# Altium project Dasch240Xl.PrjPcb
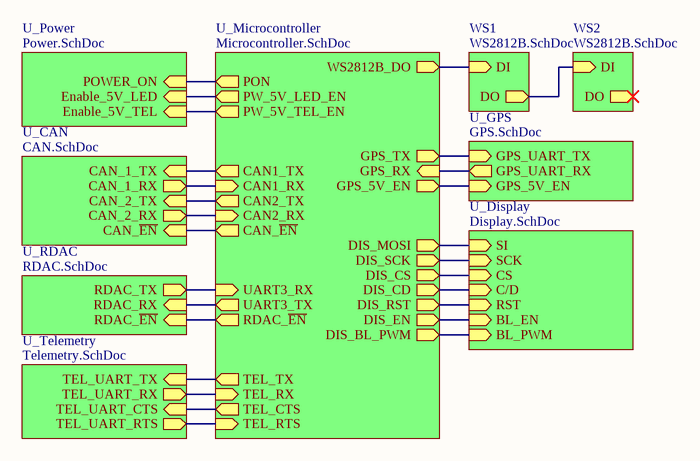
[diagram p0: Main.SchDoc]
9 sheets, 184 parts. Net scope: hierarchical (ports join the sheet entries above them; power ports are global).
Board files: PCB_SingleLedRow.PcbDoc, PCB.PcbDoc
Sheets:
  Main.SchDoc
    WS1 = WS2812B.SchDoc
    WS2 = WS2812B.SchDoc
    U_Display = Display.SchDoc
    U_Microcontroller = Microcontroller.SchDoc
    U_Telemetry = Telemetry.SchDoc
    U_GPS = GPS.SchDoc
    U_CAN = CAN.SchDoc
    U_Power = Power.SchDoc
    U_RDAC = RDAC.SchDoc

## Sheet Main.SchDoc
size A4

### Sub-sheets
U_CAN = CAN.SchDoc: CAN_1_TX (in), CAN_1_RX (out), CAN_2_RX (out), CAN_2_TX (in), CAN_~{EN} (in)
U_Display = Display.SchDoc: SI (in), SCK (in), RST (in), CS (in), C/D (in), BL_EN (in), BL_PWM (in)
U_GPS = GPS.SchDoc: GPS_UART_TX (in), GPS_UART_RX (out), GPS_5V_EN (in)
U_Microcontroller = Microcontroller.SchDoc: WS2812B_DO (out), GPS_TX (out), GPS_RX (in), TEL_TX (out), TEL_RX (in), TEL_CTS (out), TEL_RTS (in), CAN2_RX (in), CAN2_TX (out), CAN1_RX (in), CAN1_TX (out), DIS_CS (out), DIS_SCK (out), DIS_CD (out), DIS_MOSI (out), CAN_~{EN} (out), UART3_TX (out), UART3_RX (in), RDAC_~{EN} (out), GPS_5V_EN (out), DIS_EN (out), DIS_RST (out), PW_5V_TEL_EN (out), PW_5V_LED_EN (out), PON (out), DIS_BL_PWM (out)
U_Power = Power.SchDoc: Enable_5V_LED (in), Enable_5V_TEL (in), POWER_ON (in)
U_RDAC = RDAC.SchDoc: RDAC_TX (out), RDAC_RX (in), RDAC_~{EN} (in)
U_Telemetry = Telemetry.SchDoc: TEL_UART_TX (in), TEL_UART_RX (out), TEL_UART_CTS (in), TEL_UART_RTS (out)
WS1 = WS2812B.SchDoc: DI (in), DO (out)
WS2 = WS2812B.SchDoc: DI (in), DO (out)

### Nets
CAN1_RX: sheet U_Microcontroller/CAN1_RX, sheet U_CAN/CAN_1_RX
CAN1_TX: sheet U_Microcontroller/CAN1_TX, sheet U_CAN/CAN_1_TX
CAN2_RX: sheet U_Microcontroller/CAN2_RX, sheet U_CAN/CAN_2_RX
CAN2_TX: sheet U_Microcontroller/CAN2_TX, sheet U_CAN/CAN_2_TX
CAN_~{EN}: sheet U_Microcontroller/CAN_~{EN}, sheet U_CAN/CAN_~{EN}
GPS_RX: sheet U_Microcontroller/GPS_TX, sheet U_GPS/GPS_UART_TX
GPS_TX: sheet U_Microcontroller/GPS_RX, sheet U_GPS/GPS_UART_RX
SPI2_CD: sheet U_Display/C/D, sheet U_Microcontroller/DIS_CD
SPI2_MOSI: sheet U_Display/SI, sheet U_Microcontroller/DIS_MOSI
SPI2_NSS: sheet U_Display/CS, sheet U_Microcontroller/DIS_CS
SPI2_SCK: sheet U_Display/SCK, sheet U_Microcontroller/DIS_SCK
TEL_CTS: sheet U_Microcontroller/TEL_RTS, sheet U_Telemetry/TEL_UART_RTS
TEL_RTS: sheet U_Microcontroller/TEL_CTS, sheet U_Telemetry/TEL_UART_CTS
TEL_RX: sheet U_Microcontroller/TEL_TX, sheet U_Telemetry/TEL_UART_TX
TEL_TX: sheet U_Microcontroller/TEL_RX, sheet U_Telemetry/TEL_UART_RX
NetD1_WS1_4: sheet WS1/DI, sheet U_Microcontroller/WS2812B_DO
NetD1_WS2_4: sheet WS1/DO, sheet WS2/DI
NetD25_2: sheet U_Microcontroller/PON, sheet U_Power/POWER_ON
NetDISP_37: sheet U_Display/RST, sheet U_Microcontroller/DIS_RST
NetQ2_4: sheet U_Microcontroller/GPS_5V_EN, sheet U_GPS/GPS_5V_EN
NetQ3_1: sheet U_Microcontroller/RDAC_~{EN}, sheet U_RDAC/RDAC_~{EN}
NetQ4_4: sheet U_Display/BL_EN, sheet U_Microcontroller/DIS_EN
NetR15_2: sheet U_Microcontroller/PW_5V_LED_EN, sheet U_Power/Enable_5V_LED
NetR16_2: sheet U_Microcontroller/PW_5V_TEL_EN, sheet U_Power/Enable_5V_TEL
NetRaceDAC_3: sheet U_Microcontroller/UART3_RX, sheet U_RDAC/RDAC_TX
NetRaceDAC_4: sheet U_Microcontroller/UART3_TX, sheet U_RDAC/RDAC_RX
NetU1_4: sheet U_Display/BL_PWM, sheet U_Microcontroller/DIS_BL_PWM

## Sheet WS2812B.SchDoc
size A4
Used 2 times, as channels WS1, WS2. Parts and nets are listed once, with the designators drawn on the sheet.
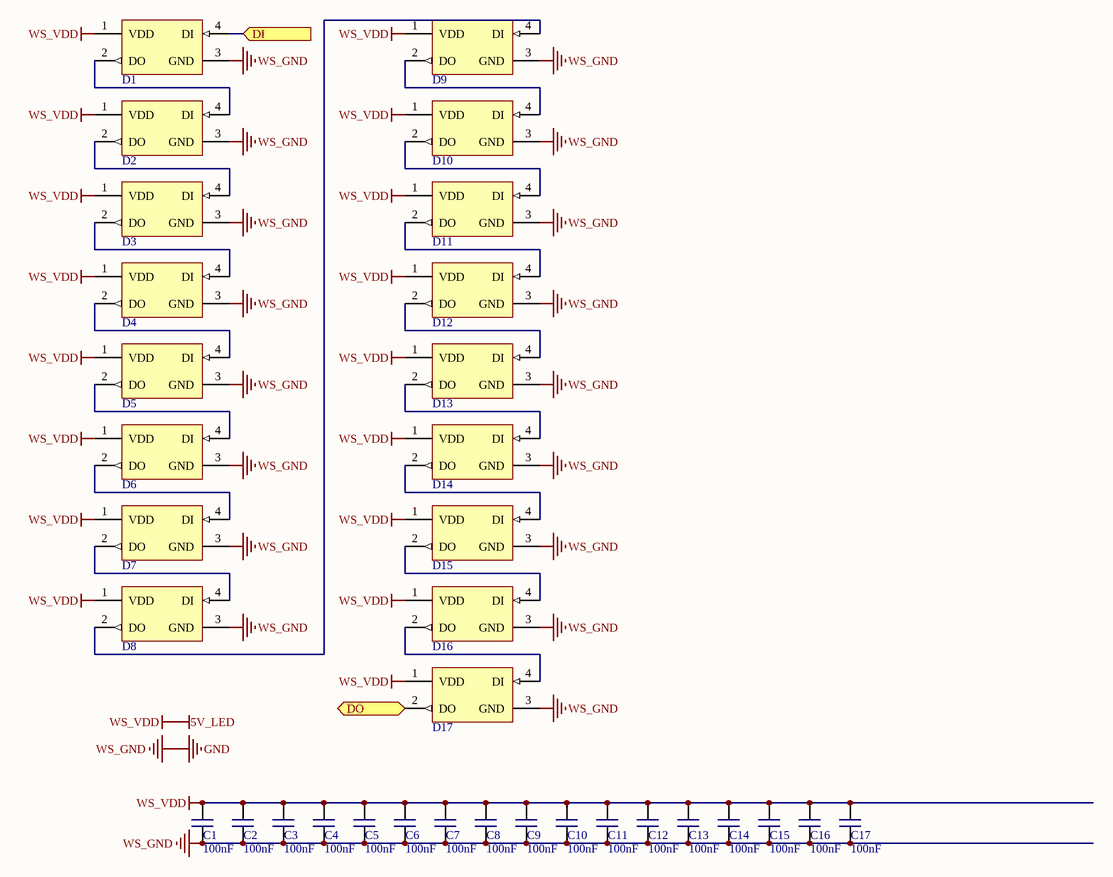
[diagram p1: WS2812B.SchDoc]

### Parts
C1  100nF  [C0603H08_M]
C2  100nF  [C0603H08_M]
C3  100nF  [C0603H08_M]
C4  100nF  [C0603H08_M]
C5  100nF  [C0603H08_M]
C6  100nF  [C0603H08_M]
C7  100nF  [C0603H08_M]
C8  100nF  [C0603H08_M]
C9  100nF  [C0603H08_M]
C10  100nF  [C0603H08_M]
C11  100nF  [C0603H08_M]
C12  100nF  [C0603H08_M]
C13  100nF  [C0603H08_M]
C14  100nF  [C0603H08_M]
C15  100nF  [C0603H08_M]
C16  100nF  [C0603H08_M]
C17  100nF  [C0603H08_M]
D1  WS2812B  [WS2812B]  (value not drawn)
D2  WS2812B  [WS2812B]  (value not drawn)
D3  WS2812B  [WS2812B]  (value not drawn)
D4  WS2812B  [WS2812B]  (value not drawn)
D5  WS2812B  [WS2812B]  (value not drawn)
D6  WS2812B  [WS2812B]  (value not drawn)
D7  WS2812B  [WS2812B]  (value not drawn)
D8  WS2812B  [WS2812B]  (value not drawn)
D9  WS2812B  [WS2812B]  (value not drawn)
D10  WS2812B  [WS2812B]  (value not drawn)
D11  WS2812B  [WS2812B]  (value not drawn)
D12  WS2812B  [WS2812B]  (value not drawn)
D13  WS2812B  [WS2812B]  (value not drawn)
D14  WS2812B  [WS2812B]  (value not drawn)
D15  WS2812B  [WS2812B]  (value not drawn)
D16  WS2812B  [WS2812B]  (value not drawn)
D17  WS2812B  [WS2812B]  (value not drawn)

### Ports
DI (in), DO (out)

### Nets
5V_LED: C1.2 C2.2 C3.2 C4.2 C5.2 C6.2 C7.2 C8.2 C9.2 C10.2 C11.2 C12.2 C13.2 C14.2 C15.2 C16.2 C17.2 D1.1(VDD) D2.1(VDD) D3.1(VDD) D4.1(VDD) D5.1(VDD) D6.1(VDD) D7.1(VDD) D8.1(VDD) D9.1(VDD) D10.1(VDD) D11.1(VDD) D12.1(VDD) D13.1(VDD) D14.1(VDD) D15.1(VDD) D16.1(VDD) D17.1(VDD)  [also labelled WS_VDD]
GND: C1.1 C2.1 C3.1 C4.1 C5.1 C6.1 C7.1 C8.1 C9.1 C10.1 C11.1 C12.1 C13.1 C14.1 C15.1 C16.1 C17.1 D1.3(GND) D2.3(GND) D3.3(GND) D4.3(GND) D5.3(GND) D6.3(GND) D7.3(GND) D8.3(GND) D9.3(GND) D10.3(GND) D11.3(GND) D12.3(GND) D13.3(GND) D14.3(GND) D15.3(GND) D16.3(GND) D17.3(GND)  [also labelled WS_GND]
DI: D1.4(DI) ; port DI
DO: D17.2(DO) ; port DO
NetD1_2: D1.2(DO) D2.4(DI)
NetD2_2: D2.2(DO) D3.4(DI)
NetD3_2: D3.2(DO) D4.4(DI)
NetD4_2: D4.2(DO) D5.4(DI)
NetD5_2: D5.2(DO) D6.4(DI)
NetD6_2: D6.2(DO) D7.4(DI)
NetD7_2: D7.2(DO) D8.4(DI)
NetD8_2: D8.2(DO) D9.4(DI)
NetD9_2: D9.2(DO) D10.4(DI)
NetD10_2: D10.2(DO) D11.4(DI)
NetD11_2: D11.2(DO) D12.4(DI)
NetD12_2: D12.2(DO) D13.4(DI)
NetD13_2: D13.2(DO) D14.4(DI)
NetD14_2: D14.2(DO) D15.4(DI)
NetD15_2: D15.2(DO) D16.4(DI)
NetD16_2: D16.2(DO) D17.4(DI)

### Channels
WS1: designators end in _WS1; ports DI=NetD1_WS1_4 DO=NetD1_WS2_4
WS2: designators end in _WS2; ports DI=NetD1_WS2_4 DO=NetD17_WS2_2

### Library data of the parts
C1-C17 = C 100nF 100V 0603 MLCC X7R: Form: 0603 [M 1608]; Temperature Coeffizient: 0ppm/°C +- 30ppm/°C; Tolerance: +-10%; Price: 0.044; Series: X7R; Voltage Rating: 100V; Temperature Range: -55°C to +125°C; Value: 100nF
D1-D17 = WS2812B: WS2812B RGB LED

## Sheet Display.SchDoc
size A4
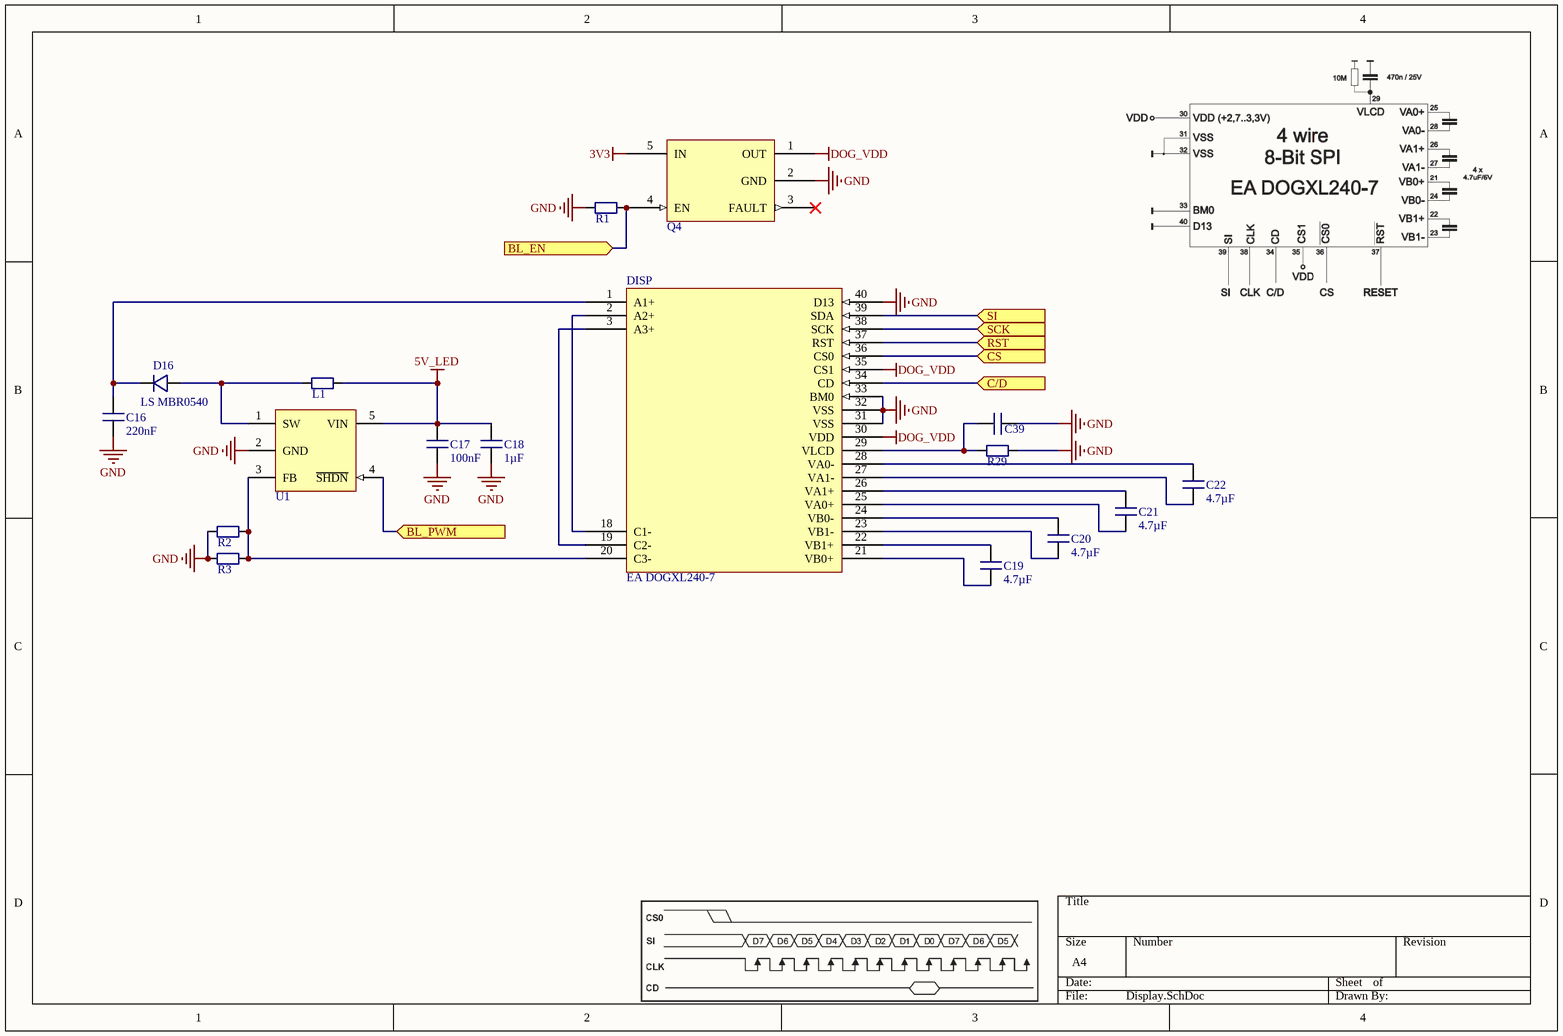
[diagram p2: Display.SchDoc]

### Parts
C16  220nF  [C0805H085_L]
C17  100nF  [C0603H08_M]
C18  1µF  [C0603H08_M]
C19  4.7µF  [C0603H08_L]
C20  4.7µF  [C0603H08_L]
C21  4.7µF  [C0603H08_L]
C22  4.7µF  [C0603H08_L]
C39  TO BE DEFINED!  [C0805H06_M]  (value not drawn)
D16  LS MBR0540  [SOD123_H]
DISP  EA DOGXL240-7  [DOGXL240*-7 + LED]
L1  .Resistor  [R0805H05_M]  (value not drawn)
Q4  Enhanced single channel power switches  [SOT-23-5]  (value not drawn)
R1  .Resistor  [R0603H05_M]  (value not drawn)
R2  .Resistor  [R0805H05_M]  (value not drawn)
R3  .Resistor  [R0805H05_M]  (value not drawn)
R29  .Resistor  [R0603H05_M]  (value not drawn)
U1  CAT4238  [SOT-23-5]  (value not drawn)

### Ports
BL_EN (in), BL_PWM (in), C/D (in), CS (in), RST (in), SCK (in), SI (in)

### Nets
3V3: Q4.5(IN)
5V_LED: C17.1 C18.1 L1.2 U1.5(VIN)
DOG_VDD: DISP.30(VDD) DISP.35(CS1) Q4.1(OUT)
GND: C16.1 C17.2 C18.2 C39.2 DISP.31(VSS) DISP.32(VSS) DISP.33(BM0) DISP.40(D13) Q4.2(GND) R1.1 R2.1 R3.1 R29.2 U1.2(GND)
SPI2_CD: DISP.34(CD) ; port C/D
SPI2_MOSI: DISP.39(SDA) ; port SI
SPI2_NSS: DISP.36(CS0) ; port CS
SPI2_SCK: DISP.38(SCK) ; port SCK
NetC16_2: C16.2 D16.1 DISP.1(A1+)
NetC19_1: C19.1 DISP.22(VB1+)
NetC19_2: C19.2 DISP.21(VB0+)
NetC20_1: C20.1 DISP.24(VB0-)
NetC20_2: C20.2 DISP.23(VB1-)
NetC21_1: C21.1 DISP.26(VA1+)
NetC21_2: C21.2 DISP.25(VA0+)
NetC22_1: C22.1 DISP.28(VA0-)
NetC22_2: C22.2 DISP.27(VA1-)
NetC39_1: C39.1 DISP.29(VLCD) R29.1
NetD16_2: D16.2 L1.1 U1.1(SW)
NetDISP_2: DISP.2(A2+) DISP.18(C1-)
NetDISP_3: DISP.3(A3+) DISP.19(C2-)
NetDISP_20: DISP.20(C3-) R2.2 R3.2 U1.3(FB)
NetDISP_37: DISP.37(RST) ; port RST
NetQ4_4: Q4.4(EN) R1.2 ; port BL_EN
NetU1_4: U1.4(~{SHDN}) ; port BL_PWM

Not connected (* = marked no-connect by the designer): Q4 3(FAULT)*

### Library data of the parts
C16 = C 220nF 50V 0805 MLCC  Y5V: Form: 0805 [M 2012]; Tolerance: +80%, -20%; Farnell Order Number: 1759269; Price: 0.0252; Series: V5Y; Voltage Rating: 50V; Temperature Range: -30°C to +85°C; Value: 220nF
C17 = C 100nF 100V 0603 MLCC X7R: as C1 on sheet WS2812B; Price: 0.044; Series: X7R; Voltage Rating: 100V; Temperature Range: -55°C to +125°C; Value: 100nF
C18 = C 1µF 6.3V 0603 MLCC X7R: Form: 0603 [M 1608]; Tolerance: +-10%; Farnell Order Number: 1865556; Price: 0.028; Series: X7R; Voltage Rating: 6.3V; Temperature Range: -55°C to +125°C; Temperature Coeffizient: N/A; Farnell: http://de.farnell.com/kemet/c0603c105k9ractu/kondensator-x7r-0603-6-3v-1uf/dp/1865556; Value: 1µF
C19-C22 = C 4.7µF 6.3V 0603 MLCC X5R: Form: 0603 [M 1608]; Tolerance: +-10%; Farnell Order Number: 2496930; Price: 0.045; Series: X5R; Voltage Rating: 6.3V; Temperature Range: -55°C to +85°C; Value: 4.7µF
C39 = _C 0805
D16 = LS MBR0540: Schottky Rectifier, 500mA, 40V
DISP = EA DOGXL240-7: 240x128
Q4 = HSS STMPS2151 High Side Switch 500mA (2151)/1000mA (2161): Farnell: http://de.farnell.com/stmicroelectronics/stmps2161str/power-switch-1ch-1000ma-sot23-5/dp/1842615; Farnell Order Number: 1842615; Price: 0,651
U1 = STU CAT4238: High Efficiency 10 LED  Boost Converter

## Sheet Microcontroller.SchDoc
size A4
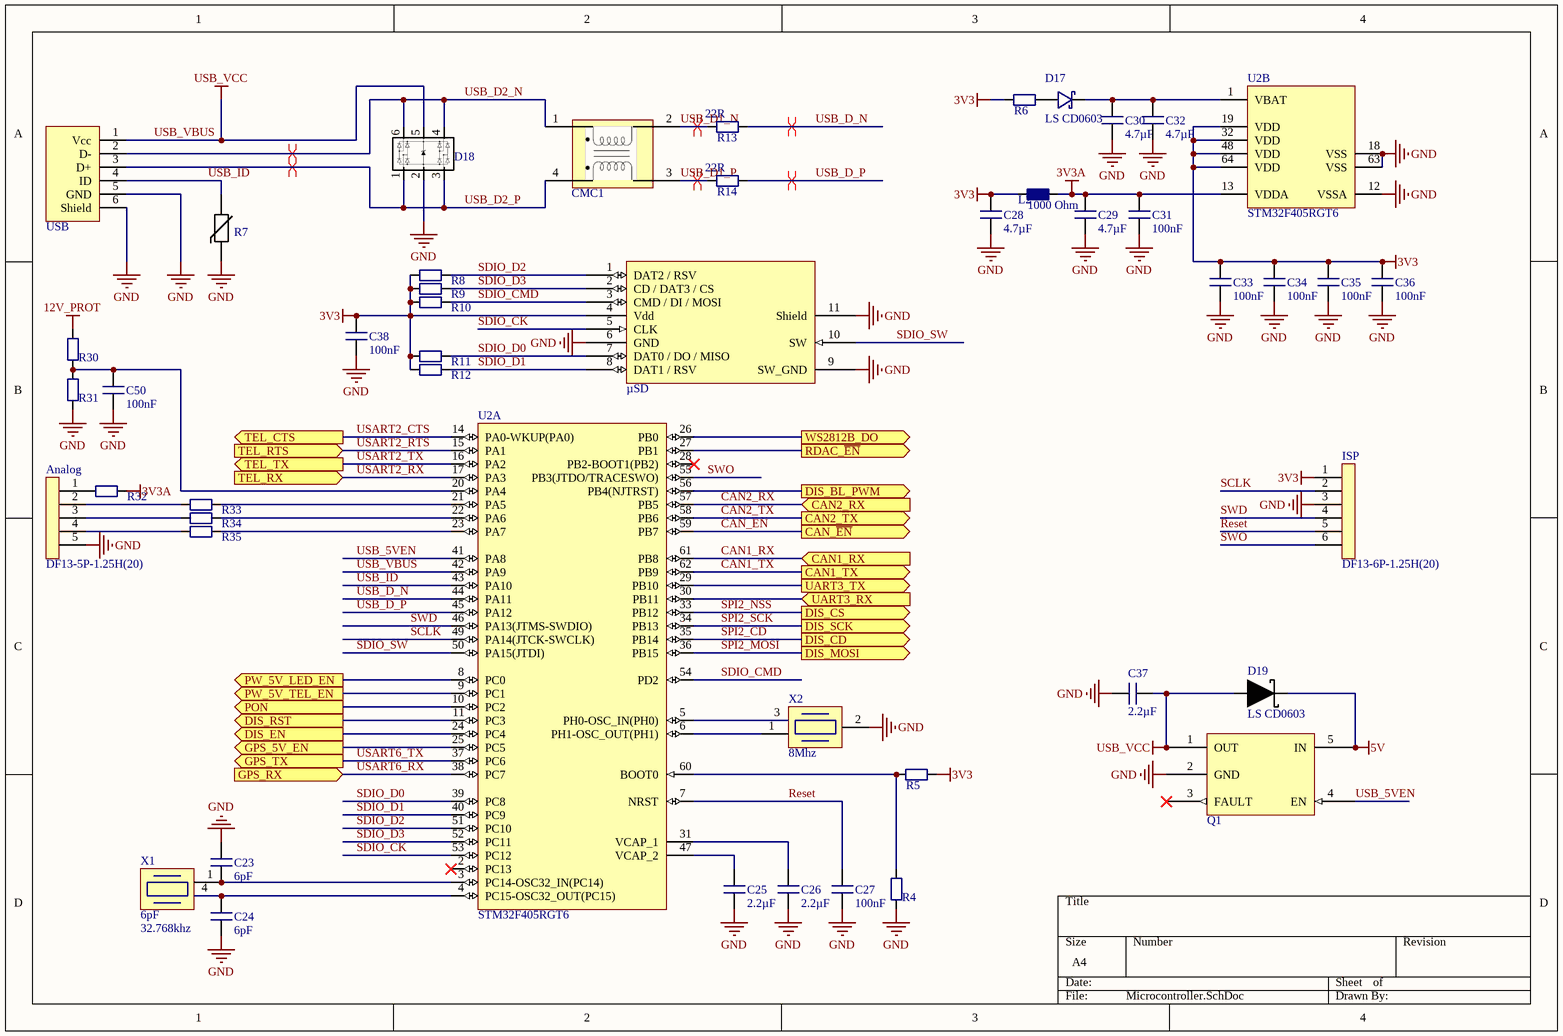
[diagram p3: Microcontroller.SchDoc]

### Parts
Analog  DF13-5P-1.25H(20)  [DF13-5P-1.25H(20)]
C23  6pF  [C0603H08_L]
C24  6pF  [C0603H08_L]
C25  2.2µF  [C0603H08_M]
C26  2.2µF  [C0603H08_M]
C27  100nF  [C0603H08_M]
C28  4.7µF  [C0603H08_L]
C29  4.7µF  [C0603H08_L]
C30  4.7µF  [C0603H08_L]
C31  100nF  [C0603H08_M]
C32  4.7µF  [C0603H08_L]
C33  100nF  [C0603H08_M]
C34  100nF  [C0603H08_M]
C35  100nF  [C0603H08_M]
C36  100nF  [C0603H08_M]
C37  2.2µF  [C0603H08_M]
C38  100nF  [C0603H08_M]
C50  100nF  [C0603H08_M]
CMC1  WURTH ELEKTRONIK - 744232090 - SIGNALFILTER, SMD, 90OHM, 370MA  [Murata 1206 CMC]  (value not drawn)
D17  LS CD0603  [CD 0603]
D18  WURTH ELEKTRONIK - 824015 - DIODENARRAY, TVS  [SOT95P255X116-6N]  (value not drawn)
D19  LS CD0603  [CD 0603]
ISP  DF13-6P-1.25H(20)  [DF13-6P-1.25H(20)]
L2  Value @ 100Mhz: 1000 Ohm  [R0603H05_L]  (hidden comment: 742792515)
Q1  Enhanced single channel power switches  [SOT-23-5]  (value not drawn)
R4  .Resistor  [R0603H05_M]  (value not drawn)
R5  .Resistor  [R0603H05_M]  (value not drawn)
R6  .Resistor  [R0603H05_M]  (value not drawn)
R7  Varistor 0805 4V WE 82550040  [Varistor 0805]  (value not drawn)
R8  .Resistor  [R0603H05_M]  (value not drawn)
R9  .Resistor  [R0603H05_M]  (value not drawn)
R10  .Resistor  [R0603H05_M]  (value not drawn)
R11  .Resistor  [R0603H05_M]  (value not drawn)
R12  .Resistor  [R0603H05_M]  (value not drawn)
R13  22R  [R0402H04_M]
R14  22R  [R0402H04_M]
R30  .Resistor  [R0603H05_M]  (value not drawn)
R31  .Resistor  [R0603H05_M]  (value not drawn)
R32  .Resistor  [R0603H05_M]  (value not drawn)
R33  .Resistor  [R0603H05_M]  (value not drawn)
R34  .Resistor  [R0603H05_M]  (value not drawn)
R35  .Resistor  [R0603H05_M]  (value not drawn)
U2  STM32F405RGT6  [STM-LQFP64_N]  (parts A,B of 2)
USB  Molex Micro USB B  [Micro USB Molex]  (value not drawn)
X1  value 32.768khz  Load: 6pF  [Abracon ABS25 Series Crystal]  (hidden comment: ABRACON - ABS25-32.768KHZ-6-1-T - QUARZ, 32.768KHZ, 6PF, SMD)
X2  value 8Mhz  [CSTCE_G15]  (hidden comment: 8MHz, 33pF)
µSD  Micro SD Connector  [Micro SD Connector 502774]  (value not drawn)

### Ports
CAN1_RX (in), CAN1_TX (out), CAN2_RX (in), CAN2_TX (out), CAN_~{EN} (out), DIS_BL_PWM (out), DIS_CD (out), DIS_CS (out), DIS_EN (out), DIS_MOSI (out), DIS_RST (out), DIS_SCK (out), GPS_5V_EN (out), GPS_RX (in), GPS_TX (out), PON (out), PW_5V_LED_EN (out), PW_5V_TEL_EN (out), RDAC_~{EN} (out), TEL_CTS (out), TEL_RTS (in), TEL_RX (in), TEL_TX (out), UART3_RX (in), UART3_TX (out), WS2812B_DO (out)

### Nets
3V3: C28.1 C33.1 C34.1 C35.1 C36.1 C38.1 ISP.1 L2.1 R5.2 R6.1 R8.1 R9.1 R10.1 R11.1 R12.1 U2.19(VDD) U2.32(VDD) U2.48(VDD) U2.64(VDD) µSD.4(Vdd)
3V3A: C29.1 C31.1 L2.2 R32.2 U2.13(VDDA)
5V: D19.1(C) Q1.5(IN)
12V_PROT: R30.2
GND: Analog.5 C23.1 C24.2 C25.2 C26.2 C27.2 C28.2 C29.2 C30.2 C31.2 C32.2 C33.2 C34.2 C35.2 C36.2 C37.1 C38.2 C50.2 D18.2 ISP.3 Q1.2(GND) R4.1 R7.2 R31.1 U2.12(VSSA) U2.18(VSS) U2.63(VSS) USB.5(GND) USB.6(Shield) X2.2 µSD.6(GND) µSD.9(SW_GND) µSD.11(Shield)
USB_VBUS: C37.2 D18.5 D19.2(A) Q1.1(OUT) U2.42(PA9) USB.1(Vcc)  [also labelled USB_VCC]
CAN1_RX: U2.61(PB8) ; port CAN1_RX
CAN1_TX: U2.62(PB9) ; port CAN1_TX
CAN2_RX: U2.57(PB5) ; port CAN2_RX
CAN2_TX: U2.58(PB6) ; port CAN2_TX
CAN_EN: U2.59(PB7) ; port CAN_~{EN}  [project net CAN_~{EN}]
Reset: C27.1 ISP.5 U2.7(NRST)
SCLK: ISP.2 U2.49(PA14(JTCK-SWCLK))
SDIO_CK: U2.53(PC12) µSD.5(CLK)
SDIO_CMD: R10.2 U2.54(PD2) µSD.3(CMD_/_DI_/_MOSI)
SDIO_D0: R11.2 U2.39(PC8) µSD.7(DAT0_/_DO_/_MISO)
SDIO_D1: R12.2 U2.40(PC9) µSD.8(DAT1_/_RSV)
SDIO_D2: R8.2 U2.51(PC10) µSD.1(DAT2_/_RSV)
SDIO_D3: R9.2 U2.52(PC11) µSD.2(CD_/_DAT3_/_CS)
SDIO_SW: U2.50(PA15(JTDI)) µSD.10(SW)
SPI2_CD: U2.35(PB14) ; port DIS_CD
SPI2_MOSI: U2.36(PB15) ; port DIS_MOSI
SPI2_NSS: U2.33(PB12) ; port DIS_CS
SPI2_SCK: U2.34(PB13) ; port DIS_SCK
SWD: ISP.4 U2.46(PA13(JTMS-SWDIO))
SWO: ISP.6 U2.55(PB3(JTDO/TRACESWO))
USART2_CTS: U2.14(PA0-WKUP(PA0)) ; port TEL_CTS  [project net TEL_RTS]
USART2_RTS: U2.15(PA1) ; port TEL_RTS  [project net TEL_CTS]
USART2_RX: U2.17(PA3) ; port TEL_RX  [project net TEL_TX]
USART2_TX: U2.16(PA2) ; port TEL_TX  [project net TEL_RX]
USART6_RX: U2.38(PC7) ; port GPS_RX  [project net GPS_TX]
USART6_TX: U2.37(PC6) ; port GPS_TX  [project net GPS_RX]
USB_5VEN: Q1.4(EN) U2.41(PA8)
USB_D1_N: CMC1.2 R13.1
USB_D1_P: CMC1.3 R14.1
USB_D2_N: CMC1.1 D18.4 D18.6 USB.2(D-)
USB_D2_P: CMC1.4 D18.1 D18.3 USB.3(D+)
USB_D_N: R13.2 U2.44(PA11)
USB_D_P: R14.2 U2.45(PA12)
USB_ID: R7.1 U2.43(PA10) USB.4(ID)
NetAnalog_1: Analog.1 R32.1
NetAnalog_2: Analog.2 R33.1
NetAnalog_3: Analog.3 R34.1
NetAnalog_4: Analog.4 R35.1
NetC23_2: C23.2 U2.3(PC14-OSC32_IN(PC14)) X1.1
NetC24_1: C24.1 U2.4(PC15-OSC32_OUT(PC15)) X1.4
NetC25_1: C25.1 U2.47(VCAP_2)
NetC26_1: C26.1 U2.31(VCAP_1)
NetC30_1: C30.1 C32.1 D17.2 U2.1(VBAT)
NetC50_1: C50.1 R30.1 R31.2 U2.20(PA4)
NetD1_WS1_4: U2.26(PB0) ; port WS2812B_DO
NetD17_1: D17.1 R6.2
NetD25_2: U2.10(PC2) ; port PON
NetDISP_37: U2.11(PC3) ; port DIS_RST
NetQ2_4: U2.25(PC5) ; port GPS_5V_EN
NetQ3_1: U2.27(PB1) ; port RDAC_~{EN}
NetQ4_4: U2.24(PC4) ; port DIS_EN
NetR4_2: R4.2 R5.1 U2.60(BOOT0)
NetR15_2: U2.8(PC0) ; port PW_5V_LED_EN
NetR16_2: U2.9(PC1) ; port PW_5V_TEL_EN
NetR33_2: R33.2 U2.21(PA5)
NetR34_2: R34.2 U2.22(PA6)
NetR35_2: R35.2 U2.23(PA7)
NetRaceDAC_3: U2.30(PB11) ; port UART3_RX
NetRaceDAC_4: U2.29(PB10) ; port UART3_TX
NetU1_4: U2.56(PB4(NJTRST)) ; port DIS_BL_PWM
NetU2_5: U2.5(PH0-OSC_IN(PH0)) X2.3
NetU2_6: U2.6(PH1-OSC_OUT(PH1)) X2.1

Not connected (* = marked no-connect by the designer): Q1 3(FAULT)*; U2 2(PC13)* 28(PB2-BOOT1(PB2))*; X1 2 3

### Layout directives
differential pair: USB_D1_N, USB_D1_P, USB_D2_N, USB_D2_P, USB_D_N, USB_D_P

### Library data of the parts
Analog = Hirose DF13-5P-1.25H(20): Circuits: 5; Connector Orientation: Right Angle; Model: DF13-5P-1.25H(20); Mounting Style: SMT
C23 C24 = C 6pF 50V 0603 MLCC C0G/NP0: Form: 0603 [M 1608]; Temperature Coeffizient: 0ppm/°C +- 30ppm/°C; Tolerance: +-0.5pF; Farnell Order Number: 1759047; Price: 0.009; Series: C0G/NP0; Voltage Rating: 50V; Temperature Range: -55°C to +125°C; Value: 6pF
C25 C26 C37 = C 2.2µF 6.3V 0603 MLCC X7R: Form: 0603 [M 1608]; Tolerance: +-10%; Farnell Order Number: 1657930; Price: 0.131; Series: X7R; Voltage Rating: 6.3V; Temperature Range: -55°C to +125°C; Temperature Coeffizient: N/A; Farnell: http://de.farnell.com/avx/06036c225kat2a/kondensator-2-2-uf-6-3v-0603-x7r/dp/1657930; Value: 2.2µF
C27 C31 C33-C36 C38 C50 = C 100nF 100V 0603 MLCC X7R: as C1 on sheet WS2812B; Price: 0.044; Series: X7R; Voltage Rating: 100V; Temperature Range: -55°C to +125°C; Value: 100nF
C28-C30 C32 = C 4.7µF 6.3V 0603 MLCC X5R: Form: 0603 [M 1608]; Tolerance: +-10%; Farnell Order Number: 2496930; Price: 0.045; Series: X5R; Voltage Rating: 6.3V; Temperature Range: -55°C to +85°C; Value: 4.7µF
CMC1 = USB CMC 1206 WE 744232090 Chip CommonMod Choke 1206: Farnell: http://de.farnell.com/wurth-elektronik/744232090/signalfilter-smd-90ohm-370ma/dp/1636474; Farnell Order Number: 1636474; Price: 0.969
D18 = USB TVS Dioden Array 824015: Farnell: http://de.farnell.com/wurth-elektronik/824015/diodenarray-tvs/dp/1748615; Price: 0.866; Farnell Order Number: 1748615
ISP = Hirose DF13-6P-1.25H(20): Circuits: 6; Connector Orientation: Right Angle; Model: DF13-6P-1.25H(20); Mounting Style: SMT
L2 = Ferrit Bead 0603 1000Ohm 300mA: DC: 0.55Ohm; Farnell: http://de.farnell.com/fair-rite/25060310270/ferrite-perle-1000ohm-0-1-0603/dp/1463451; Price: 0.018; Farnell Order Number: 1463451; DC Current: 300mA
Q1 = HSS STMPS2151 High Side Switch 500mA (2151)/1000mA (2161): Farnell: http://de.farnell.com/stmicroelectronics/stmps2161str/power-switch-1ch-1000ma-sot23-5/dp/1842615; Farnell Order Number: 1842615; Price: 0,651
R7 = Varistor 0805 4V WE 82550040: WURTH ELEKTRONIK - 82550040 - SMD VARISTOR POWER 0805 4VRMS; Farnell: http://de.farnell.com/wurth-elektronik/82550040/smd-varistor-power-0805-4vrms/dp/1636439?Ntt=1636439; Farnell Order Number: 1636439; Price: 0.598
R13 R14 = .Resistor: Value: 22R
U2 = STM32F405RGT6: ARM Cortex-M4 32-bit MCU+FPU, 210 DMIPS, 1024 kB Flash, 192 kB Internal RAM, 51 I/Os, 64-pin LQFP, -40 to 85 degC, Tray; Manufacturer: STMicroelectronics; D/A Converter: 2x12-bit; FLASH Size (Prog) (kB): 1024; I/Os (High Current): 51; Internal RAM Size (kB): 192; Operating Frequency(F) (Processor speed) (MHz): 168; Supply Voltage(Vcc) max (V): 3.6; Supply Voltage(Vcc) min (V): 1.8; DatasheetVersion: Rev. 4; PackageVersion: Rev. 4, 06/2013; PackageReference: LQFP64; PackageDescription: 64-Pin Low Profile Quad Flat Package, 10 x 10 mm Body, 0.5 mm Pitch; Supplier 1: Digi-Key; Supplier Part Number 1: 497-11767-ND; Supplier 2: Farnell; Supplier Part Number 2: 2064363; Supplier 3: Newark; Supplier Part Number 3: 73T2329; Supplier 4: Mouser; Supplier Part Number 4: 511-STM32F405RGT6; Core: ARM Cortex-M4; Packing: Tray; Mounting Technology: Surface Mount; PartNumber: STM32F405RGT6; ComponentLink1Description: Manufacturer URL; ComponentLink1URL: http://www.st.com/web/en/home.html; ComponentLink2Description: Datasheet; ComponentLink2URL: http://www.st.com/st-web-ui/static/active/en/resource/technical/document/datasheet/DM00037051.pdf; ComponentLink3Description: Package Specification; ComponentLink3URL: http://www.st.com/st-web-ui/static/active/en/resource/technical/document/datasheet/DM00037051.pdf
USB = Molex Micro USB B: MOLEX - 105017-0001 - MICRO USB B, BUCHSE, SMT, RWKL, 5POL; Farnell: http://de.farnell.com/molex/105017-0001/micro-usb-b-buchse-smt-rwkl-5pol/dp/2293836?Ntt=105017-0001; Price: 0.738; Farnell Order Number: 2293836
X1 = Quarz 32.768khz: Farnell: http://de.farnell.com/abracon/abs25-32-768khz-6-1-t/quarz-32-768khz-6pf-smd/dp/2101353; Farnell Order Number: 2101353; Price: 0.741
X2 = Ceramic Resonator 8Mhz: MURATA - CSTCE8M00G55Z-R0 - RESONATOR,SMD 8.0MHZ; Farnell: http://de.farnell.com/murata/cstce8m00g55z-r0/resonator-smd-8-0mhz/dp/1615352; Farnell Order Number: 1615352; Price: 0.338
µSD = Molex MicroSD 502774: MOLEX - 502774-0891 - BUCHSE, MICROSD, PUSH-PUSH, 1.8MM; Farnell: http://de.farnell.com/molex/502774-0891/buchse-microsd-push-push-1-8mm/dp/2064063; Farnell Order Number: 2064063; Price: 1.98

## Sheet Telemetry.SchDoc
size A4
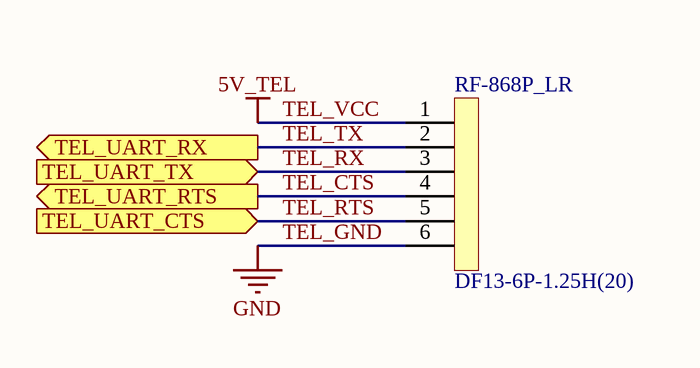
[diagram p4: Telemetry.SchDoc]

### Parts
RF-868P_LR  DF13-6P-1.25H(20)  [DF13-6P-1.25H(20)]

### Ports
TEL_UART_CTS (in), TEL_UART_RTS (out), TEL_UART_RX (out), TEL_UART_TX (in)

### Nets
GND: RF-868P_LR.6  [also labelled TEL_GND]
TEL_VCC: RF-868P_LR.1  [also labelled 5V_TEL]
TEL_CTS: RF-868P_LR.4 ; port TEL_UART_RTS
TEL_RTS: RF-868P_LR.5 ; port TEL_UART_CTS
TEL_RX: RF-868P_LR.3 ; port TEL_UART_TX
TEL_TX: RF-868P_LR.2 ; port TEL_UART_RX

### Library data of the parts
RF-868P_LR = Hirose DF13-6P-1.25H(20): as ISP on sheet Microcontroller; Model: DF13-6P-1.25H(20); Mounting Style: SMT

## Sheet GPS.SchDoc
size A4
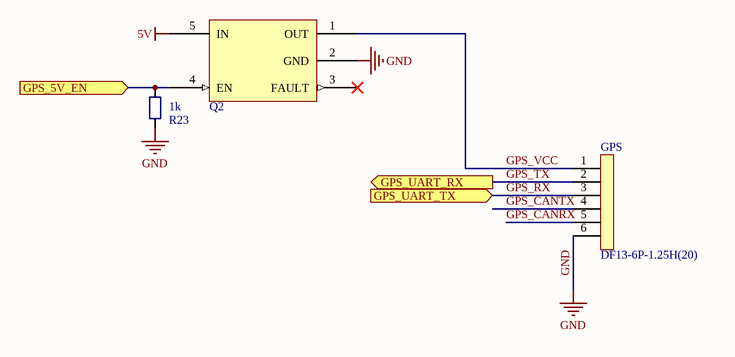
[diagram p5: GPS.SchDoc]

### Parts
GPS  DF13-6P-1.25H(20)  [DF13-6P-1.25H(20)]
Q2  Enhanced single channel power switches  [SOT-23-5]  (value not drawn)
R23  1k  [R0603H05_M]

### Ports
GPS_5V_EN (in), GPS_UART_RX (out), GPS_UART_TX (in)

### Nets
5V: Q2.5(IN)
GND: GPS.6 Q2.2(GND) R23.2
GPS_CANRX: GPS.5
GPS_CANTX: GPS.4
GPS_RX: GPS.3 ; port GPS_UART_TX
GPS_TX: GPS.2 ; port GPS_UART_RX
GPS_VCC: GPS.1 Q2.1(OUT)
NetQ2_4: Q2.4(EN) R23.1 ; port GPS_5V_EN

Not connected (* = marked no-connect by the designer): Q2 3(FAULT)*

### Library data of the parts
GPS = Hirose DF13-6P-1.25H(20): as ISP on sheet Microcontroller; Model: DF13-6P-1.25H(20); Mounting Style: SMT
Q2 = HSS STMPS2151 High Side Switch 500mA (2151)/1000mA (2161): Farnell: http://de.farnell.com/stmicroelectronics/stmps2161str/power-switch-1ch-1000ma-sot23-5/dp/1842615; Farnell Order Number: 1842615; Price: 0,651
R23 = .Resistor: Value: 1k

## Sheet CAN.SchDoc
size A4
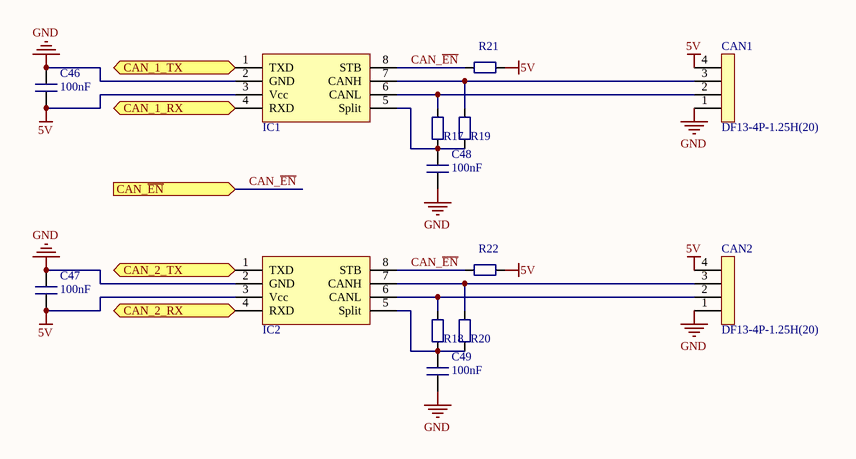
[diagram p6: CAN.SchDoc]

### Parts
C46  100nF  [C0603H08_M]
C47  100nF  [C0603H08_M]
C48  100nF  [C0603H08_M]
C49  100nF  [C0603H08_M]
CAN1  DF13-4P-1.25H(20)  [DF13-4P-1.25H(20)]
CAN2  DF13-4P-1.25H(20)  [DF13-4P-1.25H(20)]
IC1  CAN Transceiver SN65HVD1040A  [SOIC127P600X175-8N]  (value not drawn)
IC2  CAN Transceiver SN65HVD1040A  [SOIC127P600X175-8N]  (value not drawn)
R17  .Resistor  [R0603H05_M]  (value not drawn)
R18  .Resistor  [R0603H05_M]  (value not drawn)
R19  .Resistor  [R0603H05_M]  (value not drawn)
R20  .Resistor  [R0603H05_M]  (value not drawn)
R21  .Resistor  [R0603H05_M]  (value not drawn)
R22  .Resistor  [R0603H05_M]  (value not drawn)

### Ports
CAN_1_RX (out), CAN_1_TX (in), CAN_2_RX (out), CAN_2_TX (in), CAN_~{EN} (in)

### Nets
5V: C46.2 C47.2 CAN1.4 CAN2.4 IC1.3(Vcc) IC2.3(Vcc) R21.2 R22.2
GND: C46.1 C47.1 C48.2 C49.2 CAN1.1 CAN2.1 IC1.2(GND) IC2.2(GND)
CAN1_RX: IC1.4(RXD) ; port CAN_1_RX
CAN1_TX: IC1.1(TXD) ; port CAN_1_TX
CAN2_RX: IC2.4(RXD) ; port CAN_2_RX
CAN2_TX: IC2.1(TXD) ; port CAN_2_TX
CAN_~{EN}: IC1.8(STB) IC2.8(STB) R21.1 R22.1 ; port CAN_~{EN}
NetC48_1: C48.1 IC1.5(Split) R17.2 R19.2
NetC49_1: C49.1 IC2.5(Split) R18.2 R20.2
NetCAN1_2: CAN1.2 IC1.6(CANL) R17.1
NetCAN1_3: CAN1.3 IC1.7(CANH) R19.1
NetCAN2_2: CAN2.2 IC2.6(CANL) R18.1
NetCAN2_3: CAN2.3 IC2.7(CANH) R20.1

### Library data of the parts
C46-C49 = C 100nF 100V 0603 MLCC X7R: as C1 on sheet WS2812B; Price: 0.044; Series: X7R; Voltage Rating: 100V; Temperature Range: -55°C to +125°C; Value: 100nF
CAN1 CAN2 = Hirose DF13-4P-1.25H(20): Circuits: 4; Connector Orientation: Right Angle; Model: DF13-4P-1.25H(20); Mounting Style: SMT
IC1 IC2 = CAN Transceiver SN65HVD1040A: EMC-OPTIMIZED HIGH SPEED CAN TRANSCEIVER; Farnell Order Number: 2335646; Price: 1.41; Farnell: http://de.farnell.com/texas-instruments/sn65hvd1040aqdrq1/can-transceiver-1mbps-1dr-1rx-soic/dp/2335646

## Sheet Power.SchDoc
size A4
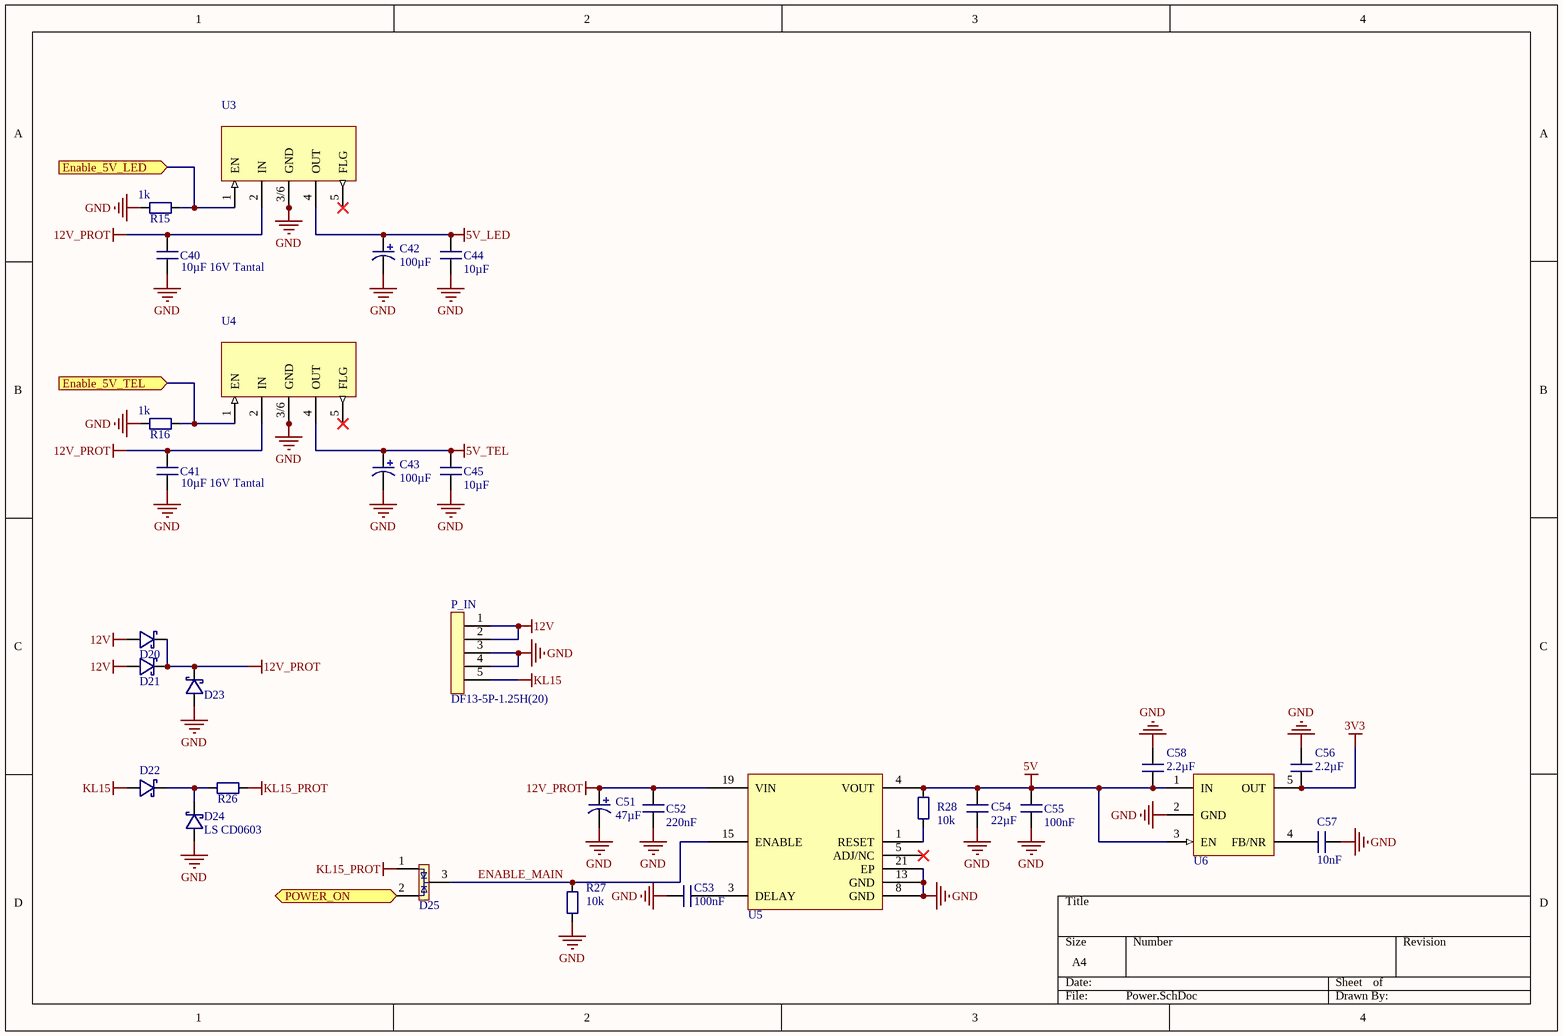
[diagram p7: Power.SchDoc]

### Parts
C40  10µF 16V Tantal  [C1206H08_M]
C41  10µF 16V Tantal  [C1206H08_M]
C42  100µF  [C1210_TANTAL_M]
C43  100µF  [C1210_TANTAL_M]
C44  10µF  [C0603H08_L]
C45  10µF  [C0603H08_L]
C51  47µF  [C1210_TANTAL_M]
C52  220nF  [C0805H085_L]
C53  100nF  [C0603H08_M]
C54  22µF  [C1210H125_M]
C55  100nF  [C0603H08_M]
C56  2.2µF  [C0603H08_M]
C57  10nF  [C0603H08_M]
C58  2.2µF  [C0603H08_M]
D20  LS PMEG6020ER  [SOD-123W]  (value not drawn)
D21  LS PMEG6020ER  [SOD-123W]  (value not drawn)
D22  LS CD0603  [CD 0603]  (value not drawn)
D23  LS PMEG6020ER  [SOD-123W]  (value not drawn)
D24  LS CD0603  [CD 0603]
D25  Diode Array BAT_54C  [SOT95P245X110-3N]  (value not drawn)
P_IN  DF13-5P-1.25H(20)  [DF13-5P-1.25H(20)]
R15  1k  [R0603H05_M]
R16  1k  [R0603H05_M]
R26  .Resistor  [R0603H05_M]  (value not drawn)
R27  10k  [R0603H05_M]
R28  10k  [R0603H05_M]
U3  MIC29151-5.0  [5-Pin TO-263]  (value not drawn)
U4  MIC29151-5.0  [5-Pin TO-263]  (value not drawn)
U5  TPS7B6750  [TSOP65P640X120_HS-21N]  (value not drawn)
U6  LDO TPS799xx Ultra Low Noise, HIGH PSRR, 200mA  [SOT-23-5]  (value not drawn)

### Ports
Enable_5V_LED (in), Enable_5V_TEL (in), POWER_ON (in)

### Nets
3V3: C56.2 U6.5(OUT)
5V: C54.1 C55.2 C58.2 R28.2 U5.4(VOUT) U6.1(IN) U6.3(EN)
5V_LED: C42.1 C44.1 U3.4(OUT)
5V_TEL: C43.1 C45.1 U4.4(OUT)  [project net TEL_VCC]
12V: D20.2 D21.2 P_IN.1 P_IN.2
12V_PROT: C40.1 C41.1 C51.1 C52.2 D20.1 D21.1 D23.1 U3.2(IN) U4.2(IN) U5.19(VIN)
GND: C40.2 C41.2 C42.2 C43.2 C44.2 C45.2 C51.2 C52.1 C53.1 C54.2 C55.1 C56.1 C57.2 C58.1 D23.2 D24.1 P_IN.3 P_IN.4 R15.1 R16.1 R27.1 U3.3(GND) U3.6(GND) U4.3(GND) U4.6(GND) U5.8(GND) U5.13(GND) U5.21(EP) U6.2(GND)
KL15: D22.1 P_IN.5
KL15_PROT: D25.1(A1) R26.2
ENABLE_MAIN: D25.3(C1/A2) R27.2 U5.15(ENABLE)
NetC53_2: C53.2 U5.3(DELAY)
NetC57_1: C57.1 U6.4(FB/NR)
NetD22_2: D22.2 D24.2 R26.1
NetD25_2: D25.2(C2) ; port POWER_ON
NetR15_2: R15.2 U3.1(EN) ; port Enable_5V_LED
NetR16_2: R16.2 U4.1(EN) ; port Enable_5V_TEL
NetR28_1: R28.1 U5.1(RESET)

Not connected (* = marked no-connect by the designer): U3 5(FLG)*; U4 5(FLG)*; U5 5(ADJ/NC)*

### Notes on the sheet
- (in symbol LDO MIC29151 5V 1.5A 26VIN Enable Error Flag TO-263-5) 3/6

### Library data of the parts
C40 C41 = _C 1206: Value: 10µF 16V Tantal; mouser: 581-TAJA106K016TNJ
C42 C43 = CPT 100µF 6.3V 1210 Tantal: Mouser Order Number: 581-TPSB107K006R0400; Voltage Rating: 6.3V; Mouser: http://www.mouser.de/ProductDetail/AVX/TPSB107K006R0400; Value: 100µF
C44 C45 = C 10µF 6.3V 0603 MLCC X5R: Form: 0603 [M 1608]; Tolerance: +-20%; Farnell Order Number: 1833804; Price: 0.167; Series: X5R; Voltage Rating: 6.3V; Temperature Range: -55°C to + 85°C; Temperature Coeffizient: N/A; Farnell: http://de.farnell.com/avx/06036d106mat2a/kondensator-0603-x5r-6-3v-10uf/dp/1833804; Value: 10µF
C51 = CPT 100µF 6.3V 1210 Tantal: CPT 47µF 16V 1210 Tantal; Mouser Order Number: 581-TCNT476M016R0150; Voltage Rating: 16V; Value: 47µF
C52 = C 220nF 50V 0805 MLCC  Y5V: as C16 on sheet Display; Farnell Order Number: 1759269; Price: 0.0252; Series: V5Y; Voltage Rating: 50V; Temperature Range: -30°C to +85°C; Value: 220nF
C53 C55 = C 100nF 100V 0603 MLCC X7R: as C1 on sheet WS2812B; Price: 0.044; Series: X7R; Voltage Rating: 100V; Temperature Range: -55°C to +125°C; Value: 100nF
C54 = _C 1210: Value: 22µF; Mouser: 80-C1210C226K9RAUTO
C56 C58 = C 2.2µF 6.3V 0603 MLCC X7R: Form: 0603 [M 1608]; Tolerance: +-10%; Farnell Order Number: 1657930; Price: 0.131; Series: X7R; Voltage Rating: 6.3V; Temperature Range: -55°C to +125°C; Temperature Coeffizient: N/A; Farnell: http://de.farnell.com/avx/06036c225kat2a/kondensator-2-2-uf-6-3v-0603-x7r/dp/1657930; Value: 2.2µF
C57 = _C 0603: Value: 10nF
D20 D21 D23 = LS PMEG6020ER: Schottky Rectifier, 2A, 60V
P_IN = Hirose DF13-5P-1.25H(20): as Analog on sheet Microcontroller; Model: DF13-5P-1.25H(20); Mounting Style: SMT
R15 R16 R27 R28 = .Resistor
  R15 R16: Value: 1k
  R27 R28: Value: 10k
U3 U4 = LDO MIC29151 5V 1.5A 26VIN Enable Error Flag TO-263-5: LDO  5V 1.5A, EN, ERR
U5 = LDO TPS7B6750 5V High-Voltage 450mA Enable: LDO  5V High-Voltage 450mA Enable
U6 = LDO TPS799xx Ultra Low Noise, HIGH PSRR, 200mA: 200mA, Low Quiescent Current, Ultra-Low Noise, High PSRR  Low Dropout Linear Regulator; Farnell Order Number: 1135403; Price: 0.707; Farnell: http://de.farnell.com/texas-instruments/tps79933ddct/v-reg-ldo-0-2a-3-3v-79933-sot5/dp/1135403

## Sheet RDAC.SchDoc
size A4
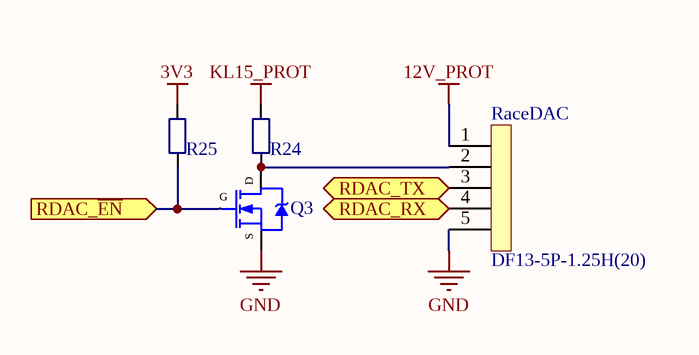
[diagram p8: RDAC.SchDoc]

### Parts
Q3  2N7002  [SOT95P245X110-3N]  (value not drawn)
R24  .Resistor  [R0603H05_M]  (value not drawn)
R25  .Resistor  [R0603H05_M]  (value not drawn)
RaceDAC  DF13-5P-1.25H(20)  [DF13-5P-1.25H(20)]

### Ports
RDAC_RX (in), RDAC_TX (out), RDAC_~{EN} (in)

### Nets
3V3: R25.1
12V_PROT: RaceDAC.1
GND: Q3.2(S) RaceDAC.5
KL15_PROT: R24.1
NetQ3_1: Q3.1(G) R25.2 ; port RDAC_~{EN}
NetQ3_3: Q3.3(D) R24.2 RaceDAC.2
NetRaceDAC_3: RaceDAC.3 ; port RDAC_TX
NetRaceDAC_4: RaceDAC.4 ; port RDAC_RX

### Library data of the parts
Q3 = 2N7002: N-Channel Enhancement Mode Field Effect Transistor; Manufactor: Texas Instruments
RaceDAC = Hirose DF13-5P-1.25H(20): as Analog on sheet Microcontroller; Model: DF13-5P-1.25H(20); Mounting Style: SMT

## Nets that join several sheets
3V3: Display (Q4.5), Microcontroller (20 pins), Power (C56.2 U6.5), RDAC (R25.1)
5V: Microcontroller (D19.1 Q1.5), GPS (Q2.5), CAN (8 pins), Power (7 pins)
5V_LED: WS1 (34 pins), WS2 (34 pins), Display (C17.1 C18.1 L1.2 U1.5), Power (C42.1 C44.1 U3.4)
12V_PROT: Microcontroller (R30.2), Power (10 pins), RDAC (RaceDAC.1)
GND: WS1 (34 pins), WS2 (34 pins), Display (14 pins), Microcontroller (33 pins), Telemetry (RF-868P_LR.6), GPS (GPS.6 Q2.2 R23.2), CAN (8 pins), Power (29 pins), RDAC (Q3.2 RaceDAC.5)
KL15_PROT: Power (D25.1 R26.2), RDAC (R24.1)
TEL_VCC: Telemetry (RF-868P_LR.1), Power (C43.1 C45.1 U4.4)
CAN1_RX: Microcontroller (U2.61), CAN (IC1.4)
CAN1_TX: Microcontroller (U2.62), CAN (IC1.1)
CAN2_RX: Microcontroller (U2.57), CAN (IC2.4)
CAN2_TX: Microcontroller (U2.58), CAN (IC2.1)
CAN_~{EN}: Microcontroller (U2.59), CAN (IC1.8 IC2.8 R21.1 R22.1)
GPS_RX: Microcontroller (U2.37), GPS (GPS.3)
GPS_TX: Microcontroller (U2.38), GPS (GPS.2)
NetD1_WS1_4: WS1 (D1_WS1.4), Microcontroller (U2.26)
NetD1_WS2_4: WS1 (D17_WS1.2), WS2 (D1_WS2.4)
NetD25_2: Microcontroller (U2.10), Power (D25.2)
NetDISP_37: Display (DISP.37), Microcontroller (U2.11)
NetQ2_4: Microcontroller (U2.25), GPS (Q2.4 R23.1)
NetQ3_1: Microcontroller (U2.27), RDAC (Q3.1 R25.2)
NetQ4_4: Display (Q4.4 R1.2), Microcontroller (U2.24)
NetR15_2: Microcontroller (U2.8), Power (R15.2 U3.1)
NetR16_2: Microcontroller (U2.9), Power (R16.2 U4.1)
NetRaceDAC_3: Microcontroller (U2.30), RDAC (RaceDAC.3)
NetRaceDAC_4: Microcontroller (U2.29), RDAC (RaceDAC.4)
NetU1_4: Display (U1.4), Microcontroller (U2.56)
SPI2_CD: Display (DISP.34), Microcontroller (U2.35)
SPI2_MOSI: Display (DISP.39), Microcontroller (U2.36)
SPI2_NSS: Display (DISP.36), Microcontroller (U2.33)
SPI2_SCK: Display (DISP.38), Microcontroller (U2.34)
TEL_CTS: Microcontroller (U2.15), Telemetry (RF-868P_LR.4)
TEL_RTS: Microcontroller (U2.14), Telemetry (RF-868P_LR.5)
TEL_RX: Microcontroller (U2.16), Telemetry (RF-868P_LR.3)
TEL_TX: Microcontroller (U2.17), Telemetry (RF-868P_LR.2)